# EasyEDA Pro project 激光主轴转接板01.eprj

# Schematic 原理图
Board Name: 电控箱转接; Create Date: 2024-04-22; Page Name: 主控MCU; Project Name: 激光主轴转接板01; Schematic Name: 原理图; Update Date: 2025-08-06; Company: 嘉立创EDA; Page Size: A3; Version: V1.0
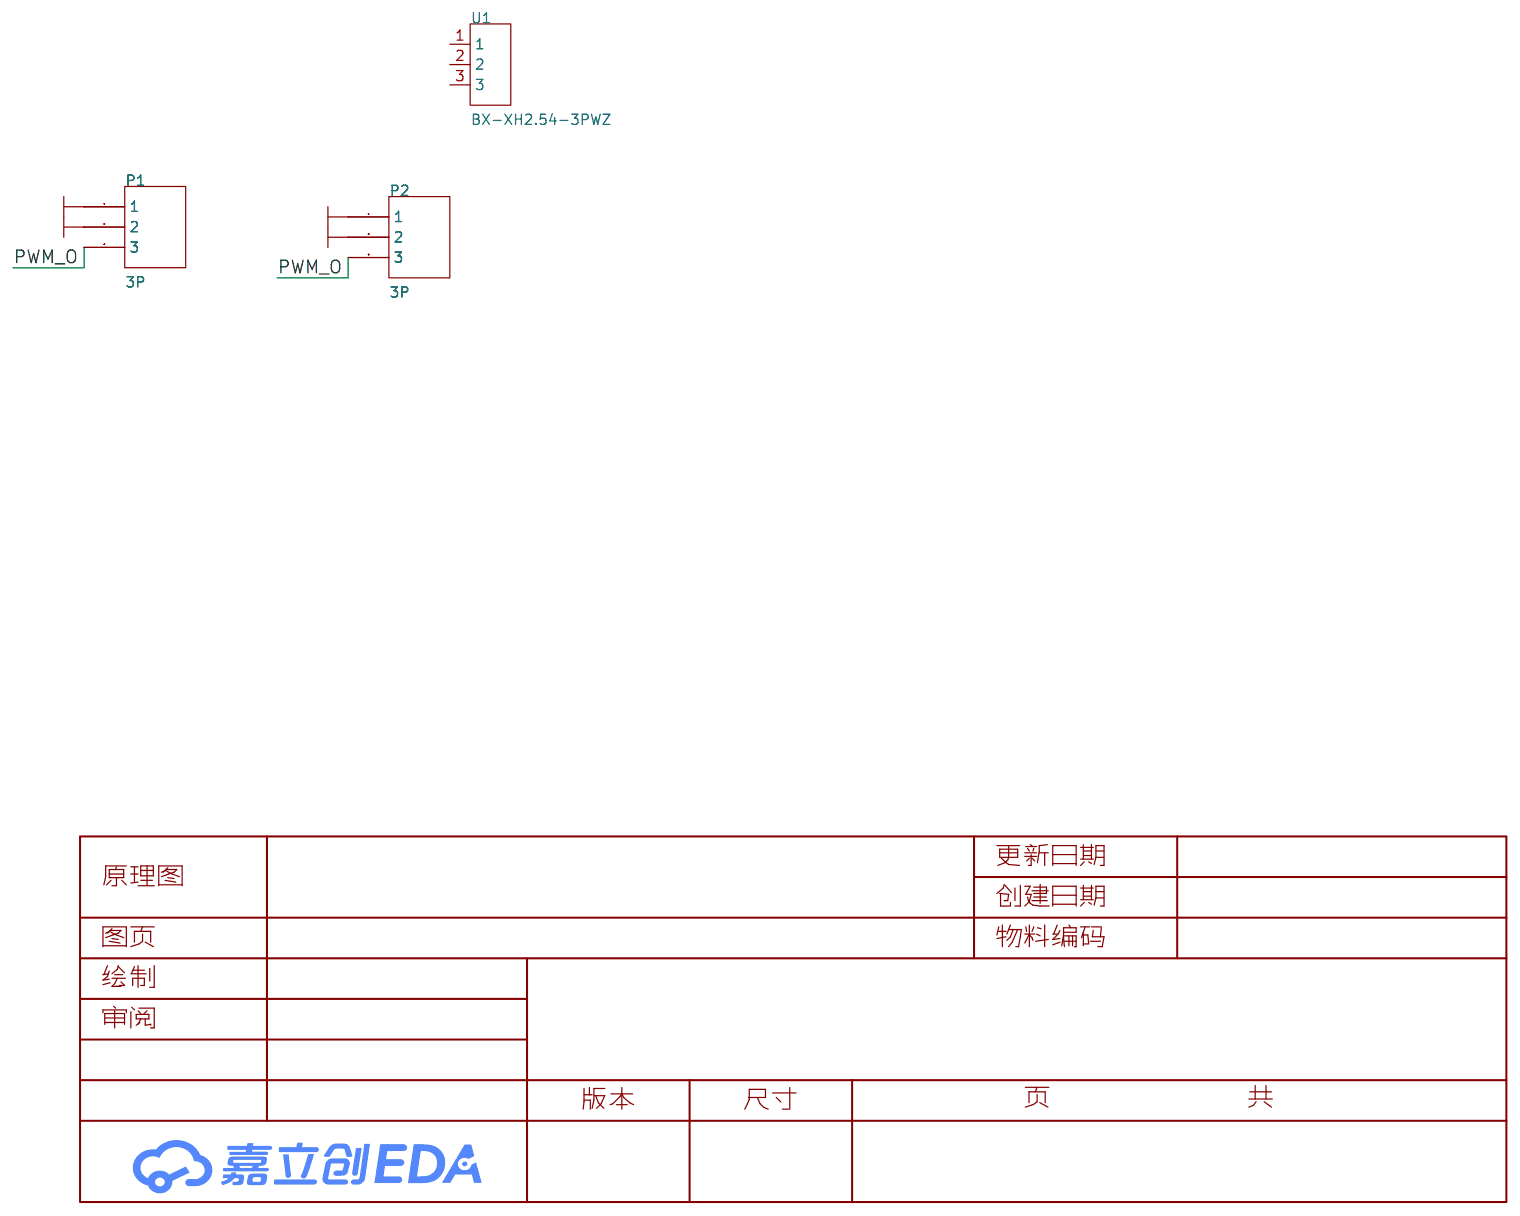
[diagram p0: schematic sheet]

## Parts
P1  3P  [HDR1X3_P]
P2  3P  [HDR1X3_P]
U1  BX-XH2.54-3PWZ  [CONN-TH_3P-P2.50_BX-XH2.54-3PWZ]

## Library data of the parts
P1 P2 = 3P: Library Name: SCH封装库
U1 = BX-XH2.54-3PWZ: LCSC Part Name: 1x3P 间距:2.5mm 弯插 系列:XH; Supplier Part: C18077843; Manufacturer: Bossie(博锡); Supplier Footprint: 弯插,P=2.54mm; JLCPCB Part Class: 扩展库; Datasheet: https://item.szlcsc.com/datasheet/BX-XH2.54-3PWZ/19218244.html; Supplier: LCSC; Pins Structure: 1x3P; Pitch: 2.5mm; Mounting Type: 弯插; Reference Series: XH; Number of Pins: 3P; Number of Rows: 1; Number of PINs Per Row: 3; Current Rating: 3A; Contact Material: 黄铜; Contact Plating: 锡; Operating Temperature: -25℃~+85℃; Voltage Rating: 250V; Plastic Material: PA66; Flame Retardant Rating: UL94V-0; Color: 白色; Z-Height of the Board: 5.9mm; X-Length of Bottom Edge on Board (Spacing Line): 10mm; Y-Width of Bottom Edge on Board: 7.32mm

## Nets
24V: P1.1 P2.1
GND: P1.2 P2.2
PWM_O: P1.3 P2.3

Not connected (* = marked no-connect by the designer): U1 1 2 3

# Board PCB
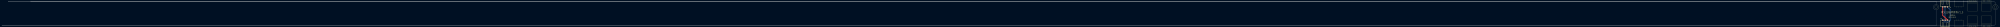
[diagram p1: board, top side]
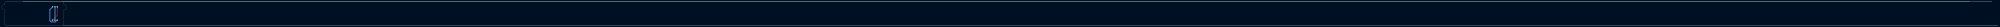
[diagram p2: board, bottom side, seen from below]

Outline 2184.9 x 26 mm; copper layers: Top Layer, Bottom Layer. Coordinates in mm from the lower left corner of the outline.
Outline path: 6.84,26 2117.9,26 2116.9,25 2116.9,23 arc(2113.9,20) 2116.9,17 2116.9,1 2117.9,0 0,0 2180.9,0 2181.9,1 2181.9,17 arc(2184.9,20) 2181.9,23 2181.9,25 2180.9,26 31.51,26 2161.9,26 6.84,26
Stack: Top Layer 0.035mm / Dielectric1 1.51mm FR4 er 4.5 / Bottom Layer 0.035mm

## Design rules (mm)
template: 用户自定义配置
spacing Default (default): track to track 0.152, other pairs 0 to 0.152
track width Default (default): min 0.254, default 0.254, max 25.4
differential pair differentialPair (default): width min 0.127, default 0.254, max 2.54; gap min 0.152, default 0.152
via Default (default): diameter min 0.25, default 0.61, max 100.025; hole min 0.2, default 0.305, max 59.995

## Placement (name value [footprint] x y rotation side)
P1  3P  [HDR1X3_P]  2126.71 20.33 180 top
P2  3P  [HDR1X3_P]  2126.9 5.63 0 top

## Footprints (pads in the part's own frame, mm; a bottom-side part is the same pattern mirrored in y, then rotated)
HDR1X3_P
  rect 1.5x1.5 hole 0.86: 1(2.54,0)
  round 1.5 hole 0.86: 2(0,0) 3(-2.54,0)

## Nets
As in the schematic.

## Routing (per net, layer and track width the routed paths; a pad name or vN(x,y) marks a point on that pad's centre or on a via; arc(x,y) is an arc through that point)
24V: length 16.9
  Top Layer w1: P2.1 2124.17,10.91 P1.1
GND: length 14.8
  Bottom Layer w1: P1.2 2126.71,5.83 P2.2
PWM_O: length 25.9
  Bottom Layer w1: P2.3 2126.32,3.68 2130.87,3.68 2132.35,5.16 2132.35,17.23 P1.3

## Text on the board
Top Silkscreen Layer: 2025-10-10 | 4040Lite | 激光主轴转接板V1.0
